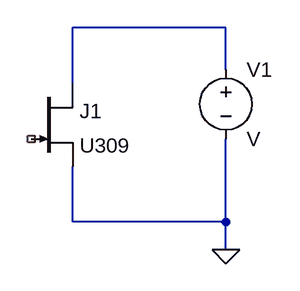
[diagram p0: schematic Draft4.asc]
Draft4.asc, the LTspice schematic file:
Version 4
SHEET 1 880 680
WIRE 352 48 176 48
WIRE 352 96 352 48
WIRE 176 112 176 48
WIRE 176 272 176 208
WIRE 352 272 352 176
WIRE 352 272 176 272
WIRE 352 304 352 272
FLAG 352 304 0
SYMBOL njf 128 112 R0
SYMATTR InstName J1
SYMATTR Value U309
SYMBOL voltage 352 80 R0
SYMATTR InstName V1

The netlist it stands for:
* Draft4.asc
J1 N001 NC_01 0 U309
V1 N001 0 V
.model NJF NJF
.model PJF PJF
.lib standard.jft
.backanno
.end